# Altium schematic sheet KeyboardMoudle3.SchDoc
size A4
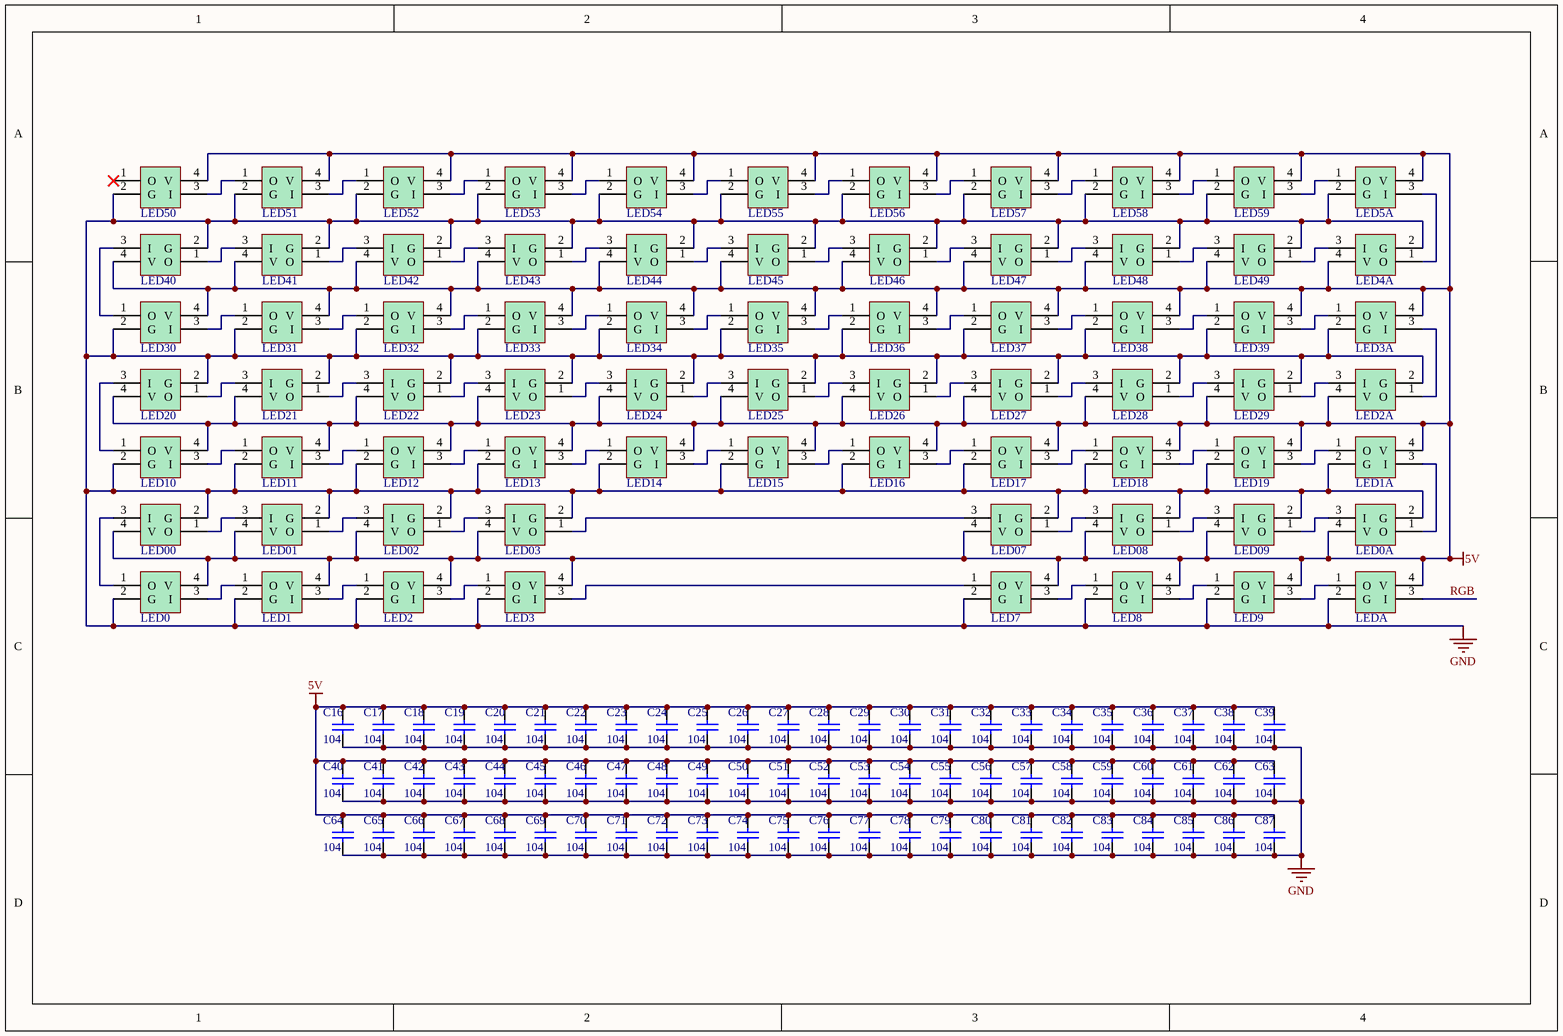
[diagram p0: KeyboardMoudle3.SchDoc]

## Parts
C16  104  [0603]
C17  104  [0603]
C18  104  [0603]
C19  104  [0603]
C20  104  [0603]
C21  104  [0603]
C22  104  [0603]
C23  104  [0603]
C24  104  [0603]
C25  104  [0603]
C26  104  [0603]
C27  104  [0603]
C28  104  [0603]
C29  104  [0603]
C30  104  [0603]
C31  104  [0603]
C32  104  [0603]
C33  104  [0603]
C34  104  [0603]
C35  104  [0603]
C36  104  [0603]
C37  104  [0603]
C38  104  [0603]
C39  104  [0603]
C40  104  [0603]
C41  104  [0603]
C42  104  [0603]
C43  104  [0603]
C44  104  [0603]
C45  104  [0603]
C46  104  [0603]
C47  104  [0603]
C48  104  [0603]
C49  104  [0603]
C50  104  [0603]
C51  104  [0603]
C52  104  [0603]
C53  104  [0603]
C54  104  [0603]
C55  104  [0603]
C56  104  [0603]
C57  104  [0603]
C58  104  [0603]
C59  104  [0603]
C60  104  [0603]
C61  104  [0603]
C62  104  [0603]
C63  104  [0603]
C64  104  [0603]
C65  104  [0603]
C66  104  [0603]
C67  104  [0603]
C68  104  [0603]
C69  104  [0603]
C70  104  [0603]
C71  104  [0603]
C72  104  [0603]
C73  104  [0603]
C74  104  [0603]
C75  104  [0603]
C76  104  [0603]
C77  104  [0603]
C78  104  [0603]
C79  104  [0603]
C80  104  [0603]
C81  104  [0603]
C82  104  [0603]
C83  104  [0603]
C84  104  [0603]
C85  104  [0603]
C86  104  [0603]
C87  104  [0603]
LED00  WS2812  [LED_WS2812_2020]  (value not drawn)
LED0  WS2812  [LED_WS2812_2020]  (value not drawn)
LED0A  WS2812  [LED_WS2812_2020]  (value not drawn)
LED01  WS2812  [LED_WS2812_2020]  (value not drawn)
LED1  WS2812  [LED_WS2812_2020]  (value not drawn)
LED1A  WS2812  [LED_WS2812_2020]  (value not drawn)
LED02  WS2812  [LED_WS2812_2020]  (value not drawn)
LED2  WS2812  [LED_WS2812_2020]  (value not drawn)
LED2A  WS2812  [LED_WS2812_2020]  (value not drawn)
LED03  WS2812  [LED_WS2812_2020]  (value not drawn)
LED3  WS2812  [LED_WS2812_2020]  (value not drawn)
LED3A  WS2812  [LED_WS2812_2020]  (value not drawn)
LED4A  WS2812  [LED_WS2812_2020]  (value not drawn)
LED5A  WS2812  [LED_WS2812_2020]  (value not drawn)
LED07  WS2812  [LED_WS2812_2020]  (value not drawn)
LED7  WS2812  [LED_WS2812_2020]  (value not drawn)
LED08  WS2812  [LED_WS2812_2020]  (value not drawn)
LED8  WS2812  [LED_WS2812_2020]  (value not drawn)
LED09  WS2812  [LED_WS2812_2020]  (value not drawn)
LED9  WS2812  [LED_WS2812_2020]  (value not drawn)
LED10  WS2812  [LED_WS2812_2020]  (value not drawn)
LED11  WS2812  [LED_WS2812_2020]  (value not drawn)
LED12  WS2812  [LED_WS2812_2020]  (value not drawn)
LED13  WS2812  [LED_WS2812_2020]  (value not drawn)
LED14  WS2812  [LED_WS2812_2020]  (value not drawn)
LED15  WS2812  [LED_WS2812_2020]  (value not drawn)
LED16  WS2812  [LED_WS2812_2020]  (value not drawn)
LED17  WS2812  [LED_WS2812_2020]  (value not drawn)
LED18  WS2812  [LED_WS2812_2020]  (value not drawn)
LED19  WS2812  [LED_WS2812_2020]  (value not drawn)
LED20  WS2812  [LED_WS2812_2020]  (value not drawn)
LED21  WS2812  [LED_WS2812_2020]  (value not drawn)
LED22  WS2812  [LED_WS2812_2020]  (value not drawn)
LED23  WS2812  [LED_WS2812_2020]  (value not drawn)
LED24  WS2812  [LED_WS2812_2020]  (value not drawn)
LED25  WS2812  [LED_WS2812_2020]  (value not drawn)
LED26  WS2812  [LED_WS2812_2020]  (value not drawn)
LED27  WS2812  [LED_WS2812_2020]  (value not drawn)
LED28  WS2812  [LED_WS2812_2020]  (value not drawn)
LED29  WS2812  [LED_WS2812_2020]  (value not drawn)
LED30  WS2812  [LED_WS2812_2020]  (value not drawn)
LED31  WS2812  [LED_WS2812_2020]  (value not drawn)
LED32  WS2812  [LED_WS2812_2020]  (value not drawn)
LED33  WS2812  [LED_WS2812_2020]  (value not drawn)
LED34  WS2812  [LED_WS2812_2020]  (value not drawn)
LED35  WS2812  [LED_WS2812_2020]  (value not drawn)
LED36  WS2812  [LED_WS2812_2020]  (value not drawn)
LED37  WS2812  [LED_WS2812_2020]  (value not drawn)
LED38  WS2812  [LED_WS2812_2020]  (value not drawn)
LED39  WS2812  [LED_WS2812_2020]  (value not drawn)
LED40  WS2812  [LED_WS2812_2020]  (value not drawn)
LED41  WS2812  [LED_WS2812_2020]  (value not drawn)
LED42  WS2812  [LED_WS2812_2020]  (value not drawn)
LED43  WS2812  [LED_WS2812_2020]  (value not drawn)
LED44  WS2812  [LED_WS2812_2020]  (value not drawn)
LED45  WS2812  [LED_WS2812_2020]  (value not drawn)
LED46  WS2812  [LED_WS2812_2020]  (value not drawn)
LED47  WS2812  [LED_WS2812_2020]  (value not drawn)
LED48  WS2812  [LED_WS2812_2020]  (value not drawn)
LED49  WS2812  [LED_WS2812_2020]  (value not drawn)
LED50  WS2812  [LED_WS2812_2020]  (value not drawn)
LED51  WS2812  [LED_WS2812_2020]  (value not drawn)
LED52  WS2812  [LED_WS2812_2020]  (value not drawn)
LED53  WS2812  [LED_WS2812_2020]  (value not drawn)
LED54  WS2812  [LED_WS2812_2020]  (value not drawn)
LED55  WS2812  [LED_WS2812_2020]  (value not drawn)
LED56  WS2812  [LED_WS2812_2020]  (value not drawn)
LED57  WS2812  [LED_WS2812_2020]  (value not drawn)
LED58  WS2812  [LED_WS2812_2020]  (value not drawn)
LED59  WS2812  [LED_WS2812_2020]  (value not drawn)
LEDA  WS2812  [LED_WS2812_2020]  (value not drawn)

## Nets
5V: C16.2 C17.2 C18.2 C19.2 C20.2 C21.2 C22.2 C23.2 C24.2 C25.2 C26.2 C27.2 C28.2 C29.2 C30.2 C31.2 C32.2 C33.2 C34.2 C35.2 C36.2 C37.2 C38.2 C39.2 C40.2 C41.2 C42.2 C43.2 C44.2 C45.2 C46.2 C47.2 C48.2 C49.2 C50.2 C51.2 C52.2 C53.2 C54.2 C55.2 C56.2 C57.2 C58.2 C59.2 C60.2 C61.2 C62.2 C63.2 C64.2 C65.2 C66.2 C67.2 C68.2 C69.2 C70.2 C71.2 C72.2 C73.2 C74.2 C75.2 C76.2 C77.2 C78.2 C79.2 C80.2 C81.2 C82.2 C83.2 C84.2 C85.2 C86.2 C87.2 LED00.4(V) LED0.4(V) LED0A.4(V) LED01.4(V) LED1.4(V) LED1A.4(V) LED02.4(V) LED2.4(V) LED2A.4(V) LED03.4(V) LED3.4(V) LED3A.4(V) LED4A.4(V) LED5A.4(V) LED07.4(V) LED7.4(V) LED08.4(V) LED8.4(V) LED09.4(V) LED9.4(V) LED10.4(V) LED11.4(V) LED12.4(V) LED13.4(V) LED14.4(V) LED15.4(V) LED16.4(V) LED17.4(V) LED18.4(V) LED19.4(V) LED20.4(V) LED21.4(V) LED22.4(V) LED23.4(V) LED24.4(V) LED25.4(V) LED26.4(V) LED27.4(V) LED28.4(V) LED29.4(V) LED30.4(V) LED31.4(V) LED32.4(V) LED33.4(V) LED34.4(V) LED35.4(V) LED36.4(V) LED37.4(V) LED38.4(V) LED39.4(V) LED40.4(V) LED41.4(V) LED42.4(V) LED43.4(V) LED44.4(V) LED45.4(V) LED46.4(V) LED47.4(V) LED48.4(V) LED49.4(V) LED50.4(V) LED51.4(V) LED52.4(V) LED53.4(V) LED54.4(V) LED55.4(V) LED56.4(V) LED57.4(V) LED58.4(V) LED59.4(V) LEDA.4(V)
GND: C16.1 C17.1 C18.1 C19.1 C20.1 C21.1 C22.1 C23.1 C24.1 C25.1 C26.1 C27.1 C28.1 C29.1 C30.1 C31.1 C32.1 C33.1 C34.1 C35.1 C36.1 C37.1 C38.1 C39.1 C40.1 C41.1 C42.1 C43.1 C44.1 C45.1 C46.1 C47.1 C48.1 C49.1 C50.1 C51.1 C52.1 C53.1 C54.1 C55.1 C56.1 C57.1 C58.1 C59.1 C60.1 C61.1 C62.1 C63.1 C64.1 C65.1 C66.1 C67.1 C68.1 C69.1 C70.1 C71.1 C72.1 C73.1 C74.1 C75.1 C76.1 C77.1 C78.1 C79.1 C80.1 C81.1 C82.1 C83.1 C84.1 C85.1 C86.1 C87.1 LED00.2(G) LED0.2(G) LED0A.2(G) LED01.2(G) LED1.2(G) LED1A.2(G) LED02.2(G) LED2.2(G) LED2A.2(G) LED03.2(G) LED3.2(G) LED3A.2(G) LED4A.2(G) LED5A.2(G) LED07.2(G) LED7.2(G) LED08.2(G) LED8.2(G) LED09.2(G) LED9.2(G) LED10.2(G) LED11.2(G) LED12.2(G) LED13.2(G) LED14.2(G) LED15.2(G) LED16.2(G) LED17.2(G) LED18.2(G) LED19.2(G) LED20.2(G) LED21.2(G) LED22.2(G) LED23.2(G) LED24.2(G) LED25.2(G) LED26.2(G) LED27.2(G) LED28.2(G) LED29.2(G) LED30.2(G) LED31.2(G) LED32.2(G) LED33.2(G) LED34.2(G) LED35.2(G) LED36.2(G) LED37.2(G) LED38.2(G) LED39.2(G) LED40.2(G) LED41.2(G) LED42.2(G) LED43.2(G) LED44.2(G) LED45.2(G) LED46.2(G) LED47.2(G) LED48.2(G) LED49.2(G) LED50.2(G) LED51.2(G) LED52.2(G) LED53.2(G) LED54.2(G) LED55.2(G) LED56.2(G) LED57.2(G) LED58.2(G) LED59.2(G) LEDA.2(G)
RGB: LEDA.3(I)
NetLED0_1: LED0.1(O) LED00.3(I)
NetLED00_1: LED00.1(O) LED01.3(I)
NetLED0_3: LED0.3(I) LED1.1(O)
NetLED0A_1: LED0A.1(O) LED1A.3(I)
NetLED0A_3: LED0A.3(I) LED09.1(O)
NetLED01_1: LED01.1(O) LED02.3(I)
NetLED1_3: LED1.3(I) LED2.1(O)
NetLED1A_1: LED1A.1(O) LED19.3(I)
NetLED02_1: LED02.1(O) LED03.3(I)
NetLED2_3: LED2.3(I) LED3.1(O)
NetLED2A_1: LED2A.1(O) LED3A.3(I)
NetLED2A_3: LED2A.3(I) LED29.1(O)
NetLED03_1: LED03.1(O) LED07.3(I)
NetLED3_3: LED3.3(I) LED7.1(O)
NetLED3A_1: LED3A.1(O) LED39.3(I)
NetLED4A_1: LED4A.1(O) LED5A.3(I)
NetLED4A_3: LED4A.3(I) LED49.1(O)
NetLED5A_1: LED5A.1(O) LED59.3(I)
NetLED07_1: LED07.1(O) LED08.3(I)
NetLED7_3: LED7.3(I) LED8.1(O)
NetLED08_1: LED08.1(O) LED09.3(I)
NetLED8_3: LED8.3(I) LED9.1(O)
NetLED9_3: LED9.3(I) LEDA.1(O)
NetLED10_1: LED10.1(O) LED20.3(I)
NetLED10_3: LED10.3(I) LED11.1(O)
NetLED11_3: LED11.3(I) LED12.1(O)
NetLED12_3: LED12.3(I) LED13.1(O)
NetLED13_3: LED13.3(I) LED14.1(O)
NetLED14_3: LED14.3(I) LED15.1(O)
NetLED15_3: LED15.3(I) LED16.1(O)
NetLED16_3: LED16.3(I) LED17.1(O)
NetLED17_3: LED17.3(I) LED18.1(O)
NetLED18_3: LED18.3(I) LED19.1(O)
NetLED20_1: LED20.1(O) LED21.3(I)
NetLED21_1: LED21.1(O) LED22.3(I)
NetLED22_1: LED22.1(O) LED23.3(I)
NetLED23_1: LED23.1(O) LED24.3(I)
NetLED24_1: LED24.1(O) LED25.3(I)
NetLED25_1: LED25.1(O) LED26.3(I)
NetLED26_1: LED26.1(O) LED27.3(I)
NetLED27_1: LED27.1(O) LED28.3(I)
NetLED28_1: LED28.1(O) LED29.3(I)
NetLED30_1: LED30.1(O) LED40.3(I)
NetLED30_3: LED30.3(I) LED31.1(O)
NetLED31_3: LED31.3(I) LED32.1(O)
NetLED32_3: LED32.3(I) LED33.1(O)
NetLED33_3: LED33.3(I) LED34.1(O)
NetLED34_3: LED34.3(I) LED35.1(O)
NetLED35_3: LED35.3(I) LED36.1(O)
NetLED36_3: LED36.3(I) LED37.1(O)
NetLED37_3: LED37.3(I) LED38.1(O)
NetLED38_3: LED38.3(I) LED39.1(O)
NetLED40_1: LED40.1(O) LED41.3(I)
NetLED41_1: LED41.1(O) LED42.3(I)
NetLED42_1: LED42.1(O) LED43.3(I)
NetLED43_1: LED43.1(O) LED44.3(I)
NetLED44_1: LED44.1(O) LED45.3(I)
NetLED45_1: LED45.1(O) LED46.3(I)
NetLED46_1: LED46.1(O) LED47.3(I)
NetLED47_1: LED47.1(O) LED48.3(I)
NetLED48_1: LED48.1(O) LED49.3(I)
NetLED50_3: LED50.3(I) LED51.1(O)
NetLED51_3: LED51.3(I) LED52.1(O)
NetLED52_3: LED52.3(I) LED53.1(O)
NetLED53_3: LED53.3(I) LED54.1(O)
NetLED54_3: LED54.3(I) LED55.1(O)
NetLED55_3: LED55.3(I) LED56.1(O)
NetLED56_3: LED56.3(I) LED57.1(O)
NetLED57_3: LED57.3(I) LED58.1(O)
NetLED58_3: LED58.3(I) LED59.1(O)

Not connected (* = marked no-connect by the designer): LED50 1(O)*

## Library data of the parts
C16-C87 = CAP_0603: 贴片电容 0603
LED00 LED0 LED0A LED01 LED1 LED1A LED02 LED2 LED2A LED03 LED3 LED3A LED4A LED5A LED07 LED7 LED08 LED8 LED09 LED9-LED59 LEDA = LED_WS2812_2020: WS2812 LED